# Altium project PCB_Project.PrjPcb
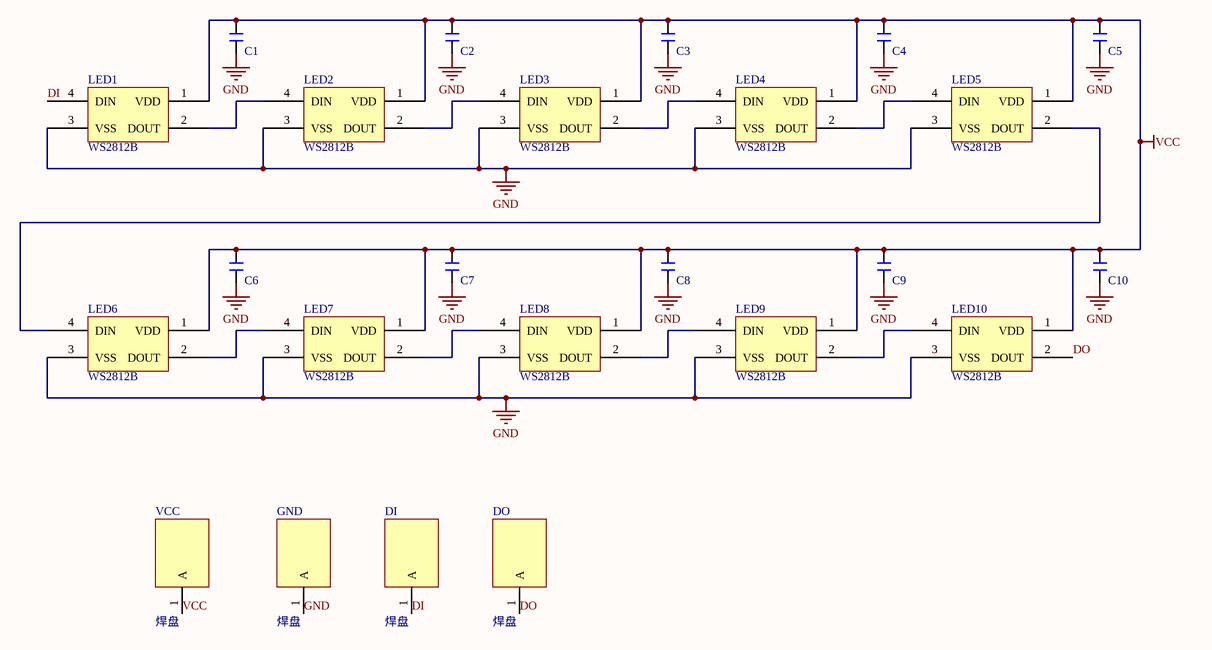
[diagram p0: Sheet1.SchDoc]
1 sheet, 24 parts. Net scope: global (net labels, ports and power ports of the same name join across sheets).
Board file: PCB1.PcbDoc

## Sheet Sheet1.SchDoc
size A4

### Parts
C1  104  [C 0805_M]  (value not drawn)
C2  104  [C 0805_M]  (value not drawn)
C3  104  [C 0805_M]  (value not drawn)
C4  104  [C 0805_M]  (value not drawn)
C5  104  [C 0805_M]  (value not drawn)
C6  104  [C 0805_M]  (value not drawn)
C7  104  [C 0805_M]  (value not drawn)
C8  104  [C 0805_M]  (value not drawn)
C9  104  [C 0805_M]  (value not drawn)
C10  104  [C 0805_M]  (value not drawn)
DI  焊盘  [PCBComponent_1]
DO  焊盘  [PCBComponent_1]
GND  焊盘  [PCBComponent_1]
LED1  WS2812B  [WS2812B]
LED2  WS2812B  [WS2812B]
LED3  WS2812B  [WS2812B]
LED4  WS2812B  [WS2812B]
LED5  WS2812B  [WS2812B]
LED6  WS2812B  [WS2812B]
LED7  WS2812B  [WS2812B]
LED8  WS2812B  [WS2812B]
LED9  WS2812B  [WS2812B]
LED10  WS2812B  [WS2812B]
VCC  焊盘  [PCBComponent_1]

### Nets
GND: C1.2 C2.2 C3.1 C4.1 C5.2 C6.1 C7.1 C8.2 C9.1 C10.1 GND.1(A) LED1.3(VSS) LED2.3(VSS) LED3.3(VSS) LED4.3(VSS) LED5.3(VSS) LED6.3(VSS) LED7.3(VSS) LED8.3(VSS) LED9.3(VSS) LED10.3(VSS)
VCC: C1.1 C2.1 C3.2 C4.2 C5.1 C6.2 C7.2 C8.1 C9.2 C10.2 LED1.1(VDD) LED2.1(VDD) LED3.1(VDD) LED4.1(VDD) LED5.1(VDD) LED6.1(VDD) LED7.1(VDD) LED8.1(VDD) LED9.1(VDD) LED10.1(VDD) VCC.1(A)
DI: DI.1(A) LED1.4(DIN)
DO: DO.1(A) LED10.2(DOUT)
NetLED1_2: LED1.2(DOUT) LED2.4(DIN)
NetLED2_2: LED2.2(DOUT) LED3.4(DIN)
NetLED3_2: LED3.2(DOUT) LED4.4(DIN)
NetLED4_2: LED4.2(DOUT) LED5.4(DIN)
NetLED5_2: LED5.2(DOUT) LED6.4(DIN)
NetLED6_2: LED6.2(DOUT) LED7.4(DIN)
NetLED7_2: LED7.2(DOUT) LED8.4(DIN)
NetLED8_2: LED8.2(DOUT) LED9.4(DIN)
NetLED9_2: LED9.2(DOUT) LED10.4(DIN)

### Library data of the parts
C1-C10 = C: 无极性贴片电容; 版权归属: 源创客; BOM名称: 无极性贴片电容; 学习资源: www.ooocke.com